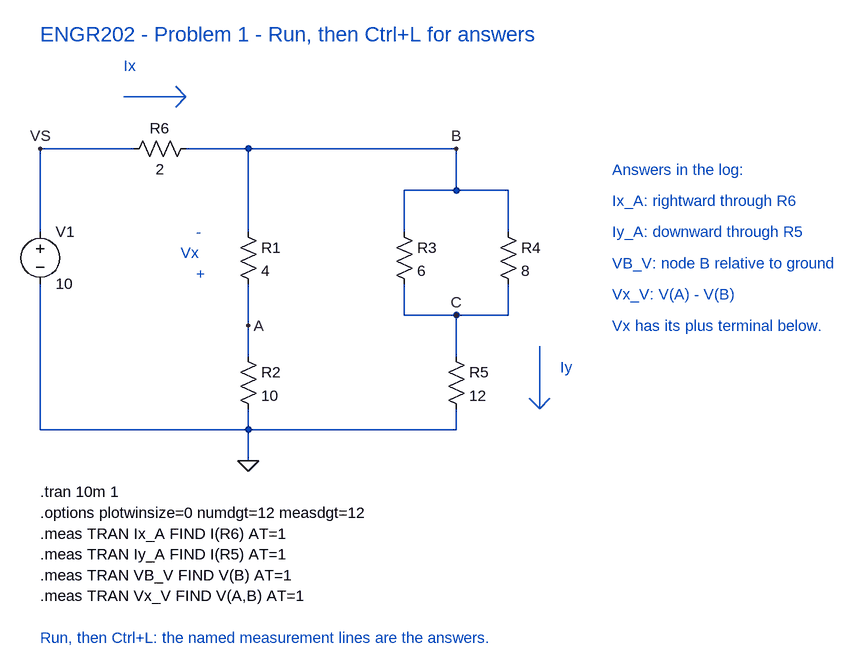
[diagram p0: schematic Problem1_Log.asc]
Problem1_Log.asc, the LTspice schematic file:
Version 4
SHEET 1 1520 1040
WIRE 80 128 224 128
WIRE 304 128 400 128
WIRE 400 128 720 128
WIRE 80 128 80 256
WIRE 80 336 80 560
WIRE 400 128 400 256
WIRE 400 336 400 400
WIRE 400 400 400 448
WIRE 400 528 400 560
WIRE 720 128 720 192
WIRE 640 192 720 192
WIRE 720 192 800 192
WIRE 640 192 640 256
WIRE 800 192 800 256
WIRE 640 336 640 384
WIRE 800 336 800 384
WIRE 640 384 720 384
WIRE 720 384 800 384
WIRE 720 384 720 448
WIRE 720 528 720 560
WIRE 80 560 400 560
WIRE 400 560 720 560
WIRE 400 560 400 608
FLAG 80 128 VS
FLAG 720 128 B
FLAG 400 400 A
FLAG 720 384 C
FLAG 400 608 0
SYMBOL voltage 80 240 R0
SYMATTR InstName V1
SYMATTR Value 10
SYMBOL res 208 144 R270
WINDOW 0 32 56 VTop 2
WINDOW 3 0 56 VBottom 2
SYMATTR InstName R6
SYMATTR Value 2
SYMBOL res 384 240 R0
SYMATTR InstName R1
SYMATTR Value 4
SYMBOL res 384 432 R0
SYMATTR InstName R2
SYMATTR Value 10
SYMBOL res 624 240 R0
SYMATTR InstName R3
SYMATTR Value 6
SYMBOL res 784 240 R0
SYMATTR InstName R4
SYMATTR Value 8
SYMBOL res 704 432 R0
SYMATTR InstName R5
SYMATTR Value 12
LINE Normal 208 48 304 48
LINE Normal 304 48 288 32
LINE Normal 304 48 288 64
LINE Normal 848 432 848 528
LINE Normal 848 528 832 512
LINE Normal 848 528 864 512
TEXT 208 0 Left 2 ;Ix
TEXT 880 464 Left 2 ;Iy
TEXT 320 256 Left 2 ;-
TEXT 296 288 Left 2 ;Vx
TEXT 320 320 Left 2 ;+
TEXT 80 -48 Left 3 ;ENGR202 - Problem 1 - Run, then Ctrl+L for answers
TEXT 960 160 Left 2 ;Answers in the log:
TEXT 960 208 Left 2 ;Ix_A: rightward through R6
TEXT 960 256 Left 2 ;Iy_A: downward through R5
TEXT 960 304 Left 2 ;VB_V: node B relative to ground
TEXT 960 352 Left 2 ;Vx_V: V(A) - V(B)
TEXT 960 400 Left 2 ;Vx has its plus terminal below.
TEXT 80 656 Left 2 !.tran 10m 1
TEXT 80 688 Left 2 !.options plotwinsize=0 numdgt=12 measdgt=12
TEXT 80 720 Left 2 !.meas TRAN Ix_A FIND I(R6) AT=1
TEXT 80 752 Left 2 !.meas TRAN Iy_A FIND I(R5) AT=1
TEXT 80 784 Left 2 !.meas TRAN VB_V FIND V(B) AT=1
TEXT 80 816 Left 2 !.meas TRAN Vx_V FIND V(A,B) AT=1
TEXT 80 880 Left 2 ;Run, then Ctrl+L: the named measurement lines are the answers.

The netlist it stands for:
* Problem1_Log.asc
V1 VS 0 10
R6 VS B 2
R1 B A 4
R2 A 0 10
R3 B C 6
R4 B C 8
R5 C 0 12
* Ix
* Iy
* -
* Vx
* +
* ENGR202 - Problem 1 - Run, then Ctrl+L for answers
* Answers in the log:
* Ix_A: rightward through R6
* Iy_A: downward through R5
* VB_V: node B relative to ground
* Vx_V: V(A) - V(B)
* Vx has its plus terminal below.
.tran 10m 1
.options plotwinsize=0 numdgt=12 measdgt=12
.meas TRAN Ix_A FIND I(R6) AT=1
.meas TRAN Iy_A FIND I(R5) AT=1
.meas TRAN VB_V FIND V(B) AT=1
.meas TRAN Vx_V FIND V(A,B) AT=1
* Run, then Ctrl+L: the named measurement lines are the answers.
.backanno
.end